# Altium schematic sheet Audio_Amp.SchDoc
size A4
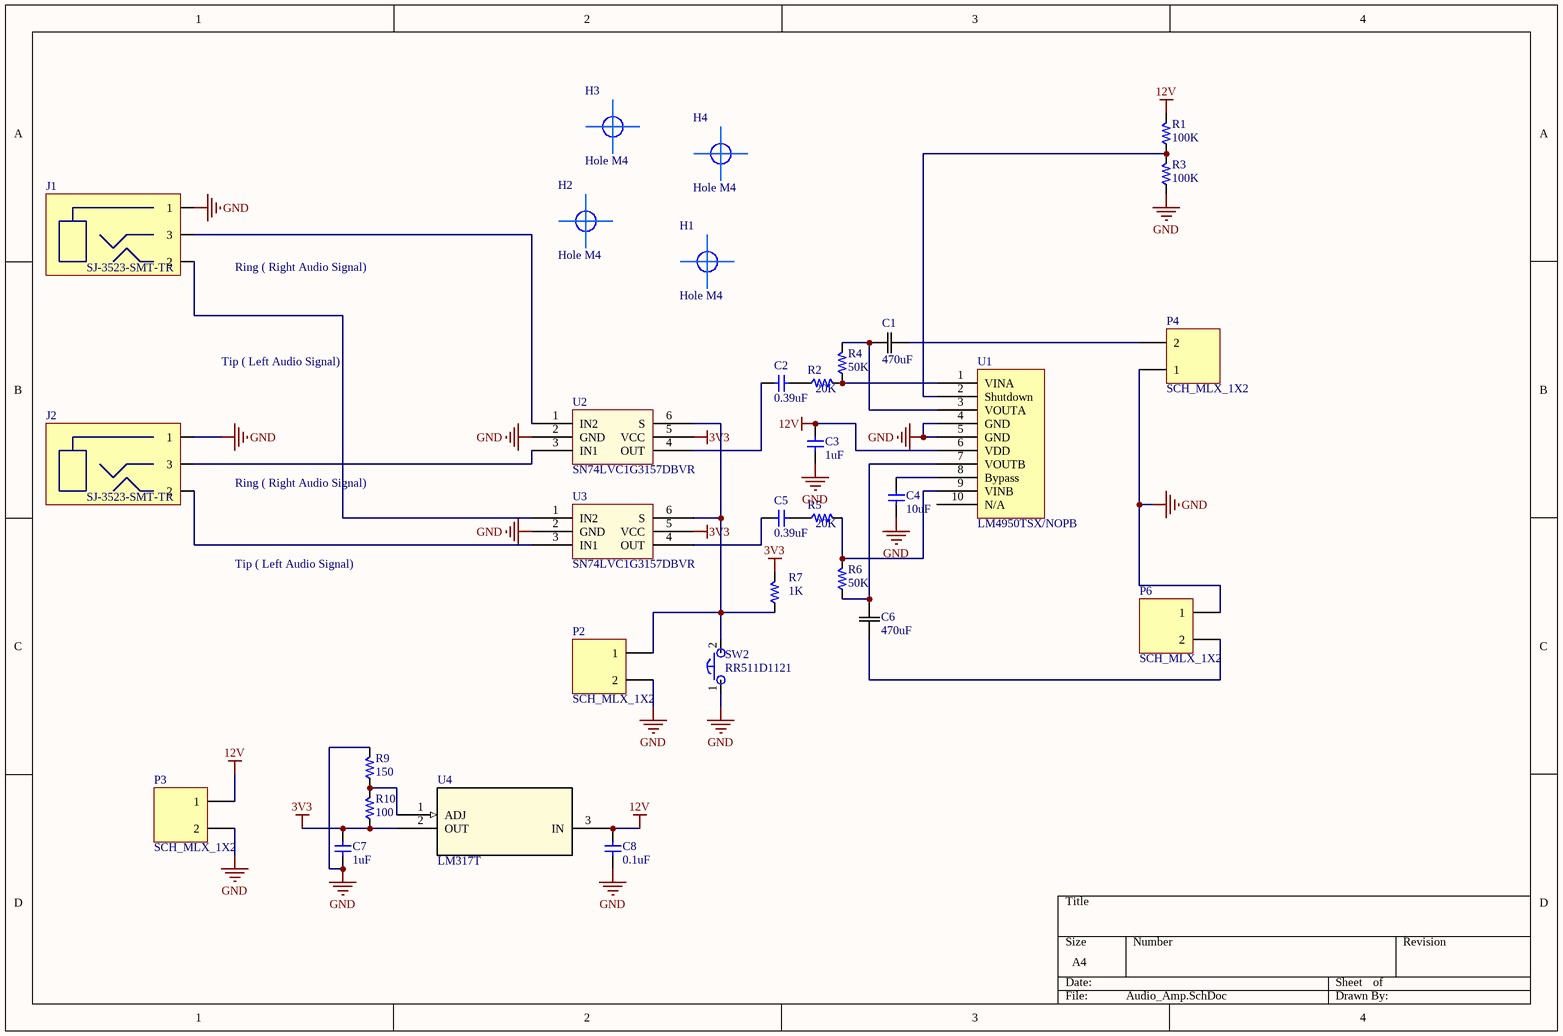
[diagram p0: Audio_Amp.SchDoc]

## Parts
C1  470uF  [CAP_PAN_10X12.5]
C2  value 0.39uF  [PCB_GENERIC_SMD_0603]  (hidden comment: C060-000U39-00)
C3  value 1uF  [PCB_GENERIC_SMD_0603]  (hidden comment: C060-000U39-00)
C4  value 10uF  [PCB_GENERIC_SMD_0603]  (hidden comment: C060-000U39-00)
C5  value 0.39uF  [PCB_GENERIC_SMD_0603]  (hidden comment: C060-000U39-00)
C6  470uF  [CAP_PAN_10X12.5]
C7  value 1uF  [PCB_GENERIC_SMD_0603]  (hidden comment: C060-000U39-00)
C8  value 0.1uF  [PCB_GENERIC_SMD_0603]  (hidden comment: C060-000U39-00)
H1  Hole M4  [#10Hole]
H2  Hole M4  [#10Hole]
H3  Hole M4  [#10Hole]
H4  Hole M4  [#10Hole]
J1  SJ-3523-SMT-TR  [CUI_SJ-3523-SMT-TR]
J2  SJ-3523-SMT-TR  [CUI_SJ-3523-SMT-TR]
P2  SCH_MLX_1X2  [PCB_MLX_MICROFIT_1X2]
P3  SCH_MLX_1X2  [PCB_MLX_MICROFIT_1X2]
P4  SCH_MLX_1X2  [PCB_MLX_MICROFIT_1X2]
P6  SCH_MLX_1X2  [PCB_MLX_MICROFIT_1X2]
R1  value 100K  [PCB_GENERIC_SMD_0603]  (hidden comment: R060-00203-01)
R2  value 20K  [PCB_GENERIC_SMD_0603]  (hidden comment: R060-00203-01)
R3  value 100K  [PCB_GENERIC_SMD_0603]  (hidden comment: R060-00203-01)
R4  value 50K  [PCB_GENERIC_SMD_0603]  (hidden comment: R060-00203-01)
R5  value 20K  [PCB_GENERIC_SMD_0603]  (hidden comment: R060-00203-01)
R6  value 50K  [PCB_GENERIC_SMD_0603]  (hidden comment: R060-00203-01)
R7  value 1K  [PCB_GENERIC_SMD_0603]  (hidden comment: R060-00203-01)
R9  value 150  [PCB_GENERIC_SMD_0603]  (hidden comment: R060-00203-01)
R10  value 100  [PCB_GENERIC_SMD_0603]  (hidden comment: R060-00203-01)
SW2  RR511D1121  [RR511D1121]
U1  LM4950TSX/NOPB  [TS9A]
U2  SN74LVC1G3157DBVR  [SOT95P280X145-6N]
U3  SN74LVC1G3157DBVR  [SOT95P280X145-6N]
U4  LM317T  [TO-220]

## Nets
3V3: C7.2 R7.2 R10.1 U2.5(VCC) U3.5(VCC) U4.2(OUT)
12V: C3.2 C8.2 P3.1 R1.2 U1.6(VDD) U4.3(IN)
GND: C3.1 C4.1 C7.1 C8.1 J1.1 J2.1 P2.2 P3.2 P4.1 P6.1 R3.1 R9.2 SW2.1 U1.4(GND) U1.5(GND) U2.2(GND) U3.2(GND)
NetC1_1: C1.1 R4.2 U1.3(VOUTA)
NetC1_2: C1.2 P4.2
NetC2_1: C2.1 U2.4(OUT)
NetC2_2: C2.2 R2.1
NetC4_2: C4.2 U1.8(Bypass)
NetC5_1: C5.1 U3.4(OUT)
NetC5_2: C5.2 R5.1
NetC6_1: C6.1 R6.1 U1.7(VOUTB)
NetC6_2: C6.2 P6.2
NetJ1_2: J1.2 U3.1(IN2)
NetJ1_3: J1.3 U2.1(IN2)
NetJ2_2: J2.2 U3.3(IN1)
NetJ2_3: J2.3 U2.3(IN1)
NetP2_1: P2.1 R7.1 SW2.2 U2.6(S) U3.6(S)
NetR1_1: R1.1 R3.2 U1.2(Shutdown)
NetR2_2: R2.2 R4.1 U1.1(VINA)
NetR5_2: R5.2 R6.2 U1.9(VINB)
NetR9_1: R9.1 R10.2 U4.1(ADJ)

Not connected (* = marked no-connect by the designer): U1 10(N/A)

## Notes on the sheet
- Ring ( Right Audio Signal)
- Tip ( Left Audio Signal)

## Library data of the parts
C1 C6 = EEU-FR1E471B: Imported; Vendor: Panasonic; Built_By: EMA_UL_Team; Type: DEV; C: Copyright (C) 2015 Accelerated Designs. All rights reserved; Manufacturer_Part_Number: EEU-FR1E471B; RefDes: RefDes; Value: Value
C2-C5 C7 C8 = C060-000U39-00: CAP CER 0603 0.39uF 16V X5R 20%; Tolerance: 20%; Voltage: 16V; Package: 0603
H1-H4 = #10Hole
J1 J2 = SJ-3523-SMT-TR: CONN JACK STEREO 3.5MM; Value: *
R1-R7 R9 R10 = R060-00203-01: RES 0603 20K 5% 100mW; Tolerance: 1%; Power: 100mW; Package: 0603
SW2 = RR511D1121: SWITCH ROCKER SPST 20A 125V
U1 = LM4950TSX/NOPB: IC AMP AUDIO PWR 7.5W AB TO263-9; Manufacturer: TI; Digikey Part #: LM4950TSX/NOPBCT-ND; Manufacturer Part #: LM4950TSX/NOPB
U2 U3 = SN74LVC1G3157DBVR: 1 Circuit IC Switch 2:1 15 Ohm SOT-23-6; Manufacturer: TI; Digikey Part #: 296-14908-1-ND; Manufacturer Part #: SN74LVC1G3157DBVR
U4 = LM317T: IC REG LIN POS ADJ 1.5A TO220AB; VENDOR: STMicroelectronics; Built_By: EMA_UL_Team; C: Copyright (C) 2015 Accelerated Designs. All rights reserved; MANUFACTURER_PART_NUMBER: LM317T; Value: Value; Type: Type; RefDes: RefDes